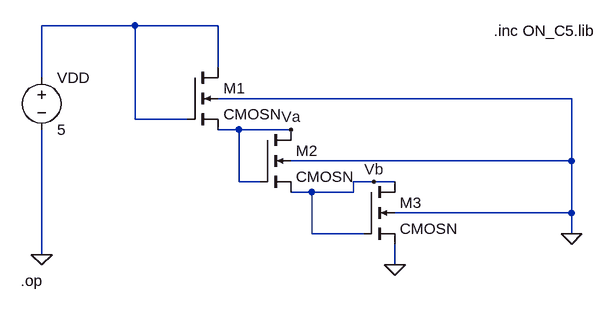
[diagram p0: schematic prob_3.asc]
prob_3.asc, the LTspice schematic file:
Version 4
SHEET 1 880 680
WIRE -48 -32 -192 -32
WIRE 80 -32 -48 -32
WIRE 80 32 80 -32
WIRE -192 48 -192 -32
WIRE 624 80 80 80
WIRE -48 112 -48 -32
WIRE 32 112 -48 112
WIRE 112 128 80 128
WIRE 192 128 112 128
WIRE 624 176 624 80
WIRE 624 176 192 176
WIRE 112 208 112 128
WIRE 144 208 112 208
WIRE 320 208 288 208
WIRE 352 208 320 208
WIRE 224 224 192 224
WIRE 288 224 288 208
WIRE 288 224 224 224
WIRE 624 256 624 176
WIRE 624 256 352 256
WIRE 224 288 224 224
WIRE 304 288 224 288
WIRE 624 288 624 256
WIRE -192 320 -192 128
WIRE 352 336 352 304
FLAG 624 288 0
FLAG 352 336 0
FLAG -192 320 0
FLAG 192 128 Va
FLAG 320 208 Vb
SYMBOL nmos4 32 32 R0
SYMATTR InstName M1
SYMATTR Value2 l=0.6u w=2.4u
SYMATTR Value CMOSN
SYMBOL nmos4 144 128 R0
SYMATTR InstName M2
SYMATTR Value2 l=0.6u w=2.4u
SYMATTR Value CMOSN
SYMBOL nmos4 304 208 R0
SYMATTR InstName M3
SYMATTR Value2 l=0.6u w=2.4u
SYMATTR Value CMOSN
SYMBOL voltage -192 32 R0
WINDOW 123 0 0 Left 2
WINDOW 39 0 0 Left 2
SYMATTR InstName VDD
SYMATTR Value 5
TEXT -224 360 Left 2 !.op
TEXT 504 -24 Left 2 !.inc ON_C5.lib

The netlist it stands for:
* prob_3.asc
M1 N001 N001 Va 0 CMOSN l=0.6u w=2.4u
M2 Va Va Vb 0 CMOSN l=0.6u w=2.4u
M3 Vb Vb 0 0 CMOSN l=0.6u w=2.4u
VDD N001 0 5
.model NMOS NMOS
.model PMOS PMOS
.lib standard.mos
.op
.inc ON_C5.lib
.backanno
.end